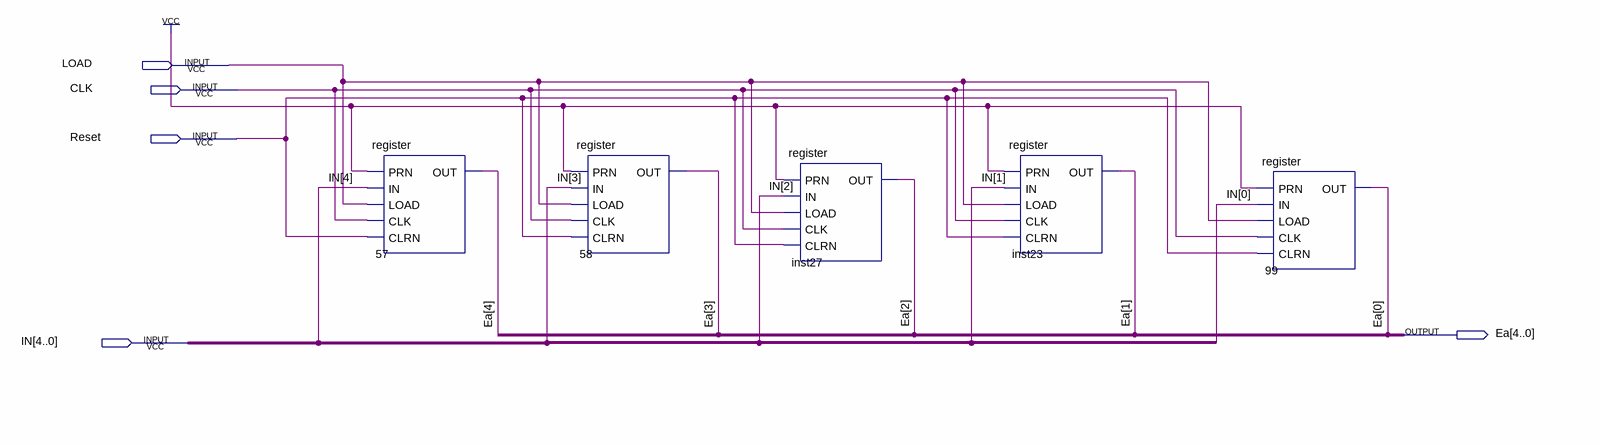
[diagram p0: schematic sheet]
// Quartus schematic moneyearn.bdf as structural Verilog: 5 symbols, 5 pins
module moneyearn (
  input  LOAD,
  input  CLK,
  input  Reset,
  input  [4:0] IN,
  output [4:0] Ea
);

  register u_57 (.PRN(1'b1), .IN(IN[4]), .LOAD(LOAD), .CLK(CLK), .CLRN(Reset), .OUT(Ea[4]));
  register u_58 (.PRN(1'b1), .IN(IN[3]), .LOAD(LOAD), .CLK(CLK), .CLRN(Reset), .OUT(Ea[3]));
  register inst27 (.PRN(1'b1), .IN(IN[2]), .LOAD(LOAD), .CLK(CLK), .CLRN(Reset), .OUT(Ea[2]));
  register inst23 (.PRN(1'b1), .IN(IN[1]), .LOAD(LOAD), .CLK(CLK), .CLRN(Reset), .OUT(Ea[1]));
  register u_99 (.PRN(1'b1), .IN(IN[0]), .LOAD(LOAD), .CLK(CLK), .CLRN(Reset), .OUT(Ea[0]));
endmodule
